# Altium schematic sheet HelperMicroProgrammer.SchDoc
size A
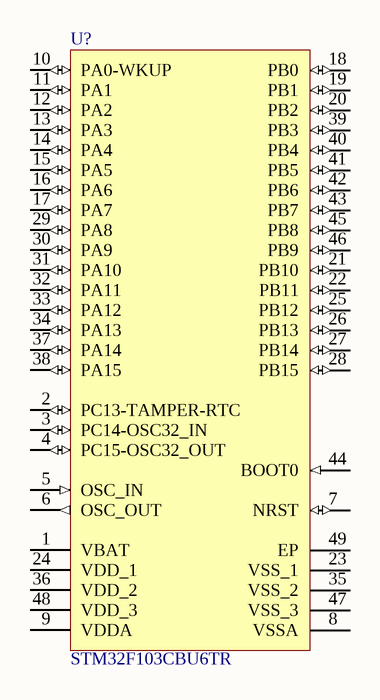
[diagram p0: HelperMicroProgrammer.SchDoc]

## Parts
U?  STM32F103CBU6TR  [STM-UFQFPN48_L]

## Nets

Not connected (* = marked no-connect by the designer): U? 1(VBAT) 2(PC13-TAMPER-RTC) 3(PC14-OSC32_IN) 4(PC15-OSC32_OUT) 5(OSC_IN) 6(OSC_OUT) 7(NRST) 8(VSSA) 9(VDDA) 10(PA0-WKUP) 11(PA1) 12(PA2) 13(PA3) 14(PA4) 15(PA5) 16(PA6) 17(PA7) 18(PB0) 19(PB1) 20(PB2) 21(PB10) 22(PB11) 23(VSS_1) 24(VDD_1) 25(PB12) 26(PB13) 27(PB14) 28(PB15) 29(PA8) 30(PA9) 31(PA10) 32(PA11) 33(PA12) 34(PA13) 35(VSS_2) 36(VDD_2) 37(PA14) 38(PA15) 39(PB3) 40(PB4) 41(PB5) 42(PB6) 43(PB7) 44(BOOT0) 45(PB8) 46(PB9) 47(VSS_3) 48(VDD_3) 49(EP)

## Library data of the parts
U? = CMP-0237-00304-1: ARM Cortex-M3 32-bit MCU, 128 KB Flash, 20 KB Internal RAM, 37 I/Os, 48-Pin UFQFPN, -40 to 85 degC, Tape and Reel; I/Os (High Current): 36; Internal RAM Size (kB): 20; Operating Frequency(F) (Processor speed) (MHz): 72; Supply Voltage(Vcc) min (V): 2; FLASH Size (Prog) (kB): 128; Packing: Tape and Reel; ComponentLink2URL: http://www.st.com/st-web-ui/static/active/en/resource/technical/document/datasheet/CD00161566.pdf; ComponentLink1Description: Manufacturer URL; Package Reference: UFQFPN48; Mounting Technology: Surface Mount; Core: ARM Cortex-M3; ComponentLink2Description: Datasheet; Package Description: 48-Pin Ultra Thin Fine Pitch Quad Flat No-Lead, 7 x 7 x 0.6 mm Body, 0.5 mm Pitch, Exposed Pad; DatasheetVersion: Rev. 17; ComponentLink1URL: http://www.st.com/